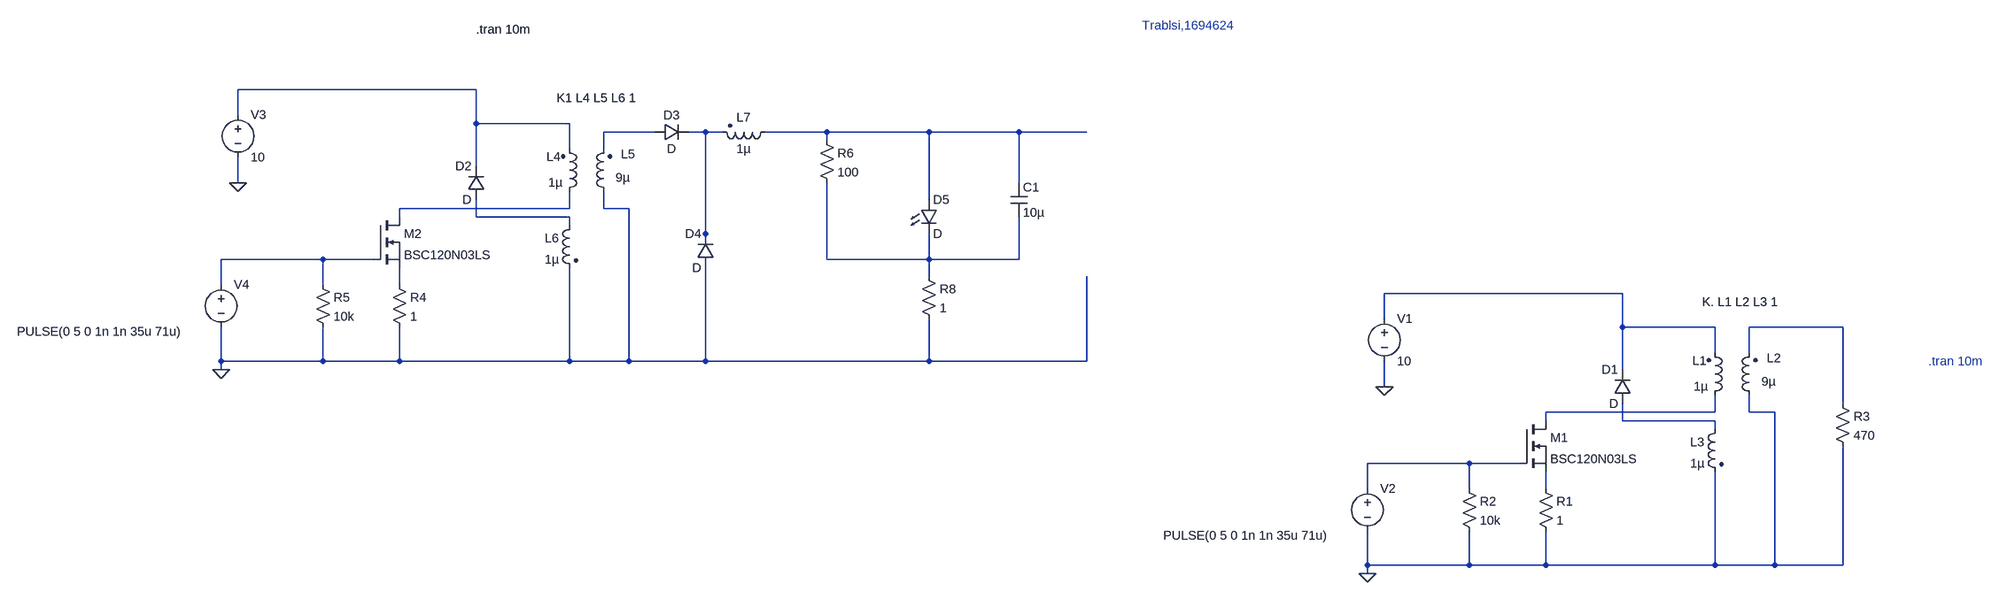
[diagram p0: schematic E8_2.asc]
E8_2.asc, the LTspice schematic file:
Version 4
SHEET 1 880 680
WIRE -2272 -432 -2720 -432
WIRE -2720 -384 -2720 -432
WIRE -2272 -368 -2272 -432
WIRE -2096 -368 -2272 -368
WIRE -1936 -352 -2032 -352
WIRE -1840 -352 -1872 -352
WIRE -1808 -352 -1840 -352
WIRE -1600 -352 -1728 -352
WIRE -1408 -352 -1600 -352
WIRE -1232 -352 -1408 -352
WIRE -1104 -352 -1232 -352
WIRE -1600 -336 -1600 -352
WIRE -2096 -320 -2096 -368
WIRE -2032 -320 -2032 -352
WIRE -2272 -288 -2272 -368
WIRE -2720 -256 -2720 -304
WIRE -1232 -256 -1232 -352
WIRE -1408 -224 -1408 -352
WIRE -2096 -208 -2096 -240
WIRE -2096 -208 -2416 -208
WIRE -2032 -208 -2032 -240
WIRE -1984 -208 -2032 -208
WIRE -2416 -192 -2416 -208
WIRE -2272 -192 -2272 -224
WIRE -2096 -192 -2272 -192
WIRE -2096 -176 -2096 -192
WIRE -1840 -160 -1840 -352
WIRE -1840 -144 -1840 -160
WIRE -2560 -112 -2752 -112
WIRE -2464 -112 -2560 -112
WIRE -1600 -112 -1600 -256
WIRE -1408 -112 -1408 -160
WIRE -1408 -112 -1600 -112
WIRE -1232 -112 -1232 -192
WIRE -1232 -112 -1408 -112
WIRE -1408 -80 -1408 -112
WIRE -2752 -64 -2752 -112
WIRE -2560 -64 -2560 -112
WIRE -2416 -64 -2416 -96
WIRE -16 -48 -464 -48
WIRE -464 0 -464 -48
WIRE -16 16 -16 -48
WIRE 160 16 -16 16
WIRE 432 16 224 16
WIRE 160 64 160 16
WIRE 224 64 224 16
WIRE -2752 80 -2752 16
WIRE -2560 80 -2560 16
WIRE -2560 80 -2752 80
WIRE -2416 80 -2416 16
WIRE -2416 80 -2560 80
WIRE -2096 80 -2096 -96
WIRE -2096 80 -2416 80
WIRE -1984 80 -1984 -208
WIRE -1984 80 -2096 80
WIRE -1840 80 -1840 -96
WIRE -1840 80 -1984 80
WIRE -1408 80 -1408 0
WIRE -1408 80 -1840 80
WIRE -1104 80 -1104 -80
WIRE -1104 80 -1408 80
WIRE -2752 96 -2752 80
WIRE -16 96 -16 16
WIRE -464 128 -464 80
WIRE 432 160 432 16
WIRE 160 176 160 144
WIRE 160 176 -160 176
WIRE 224 176 224 144
WIRE 272 176 224 176
WIRE -160 192 -160 176
WIRE -16 192 -16 160
WIRE 160 192 -16 192
WIRE 160 208 160 192
WIRE -304 272 -496 272
WIRE -208 272 -304 272
WIRE -496 320 -496 272
WIRE -304 320 -304 272
WIRE -160 320 -160 288
WIRE -496 464 -496 400
WIRE -304 464 -304 400
WIRE -304 464 -496 464
WIRE -160 464 -160 400
WIRE -160 464 -304 464
WIRE 160 464 160 288
WIRE 160 464 -160 464
WIRE 272 464 272 176
WIRE 272 464 160 464
WIRE 432 464 432 240
WIRE 432 464 272 464
WIRE -496 480 -496 464
FLAG -464 128 0
FLAG -496 480 0
FLAG -2720 -256 0
FLAG -2752 96 0
SYMBOL ind2 144 160 M180
WINDOW 0 -27 81 Left 2
WINDOW 3 -24 33 Left 2
SYMATTR InstName L1
SYMATTR Value 1µ
SYMBOL ind2 240 160 R180
WINDOW 0 -44 86 Left 2
WINDOW 3 -34 42 Left 2
SYMATTR InstName L2
SYMATTR Value 9µ
SYMBOL ind2 176 192 M0
SYMATTR InstName L3
SYMATTR Value 1µ
SYMBOL voltage -464 -16 R0
WINDOW 123 0 0 Left 0
WINDOW 39 0 0 Left 0
SYMATTR InstName V1
SYMATTR Value 10
SYMBOL diode 0 160 R180
WINDOW 0 24 64 Left 2
WINDOW 3 24 0 Left 2
SYMATTR InstName D1
SYMBOL res -176 304 R0
SYMATTR InstName R1
SYMATTR Value 1
SYMBOL res -320 304 R0
SYMATTR InstName R2
SYMATTR Value 10k
SYMBOL voltage -496 304 R0
WINDOW 3 -384 104 Left 2
WINDOW 123 0 0 Left 0
WINDOW 39 0 0 Left 0
SYMATTR Value PULSE(0 5 0 1n 1n 35u 71u)
SYMATTR InstName V2
SYMBOL res 416 144 R0
SYMATTR InstName R3
SYMATTR Value 470
SYMBOL nmos -208 192 R0
SYMATTR InstName M1
SYMATTR Value BSC120N03LS
SYMBOL ind2 -2112 -224 M180
WINDOW 0 -27 81 Left 2
WINDOW 3 -24 33 Left 2
SYMATTR InstName L4
SYMATTR Value 1µ
SYMBOL ind2 -2016 -224 R180
WINDOW 0 -44 86 Left 2
WINDOW 3 -34 42 Left 2
SYMATTR InstName L5
SYMATTR Value 9µ
SYMBOL ind2 -2080 -192 M0
SYMATTR InstName L6
SYMATTR Value 1µ
SYMBOL voltage -2720 -400 R0
WINDOW 123 0 0 Left 0
WINDOW 39 0 0 Left 0
SYMATTR InstName V3
SYMATTR Value 10
SYMBOL diode -2256 -224 R180
WINDOW 0 24 64 Left 2
WINDOW 3 24 0 Left 2
SYMATTR InstName D2
SYMBOL res -2432 -80 R0
SYMATTR InstName R4
SYMATTR Value 1
SYMBOL res -2576 -80 R0
SYMATTR InstName R5
SYMATTR Value 10k
SYMBOL voltage -2752 -80 R0
WINDOW 3 -384 104 Left 2
WINDOW 123 0 0 Left 0
WINDOW 39 0 0 Left 0
SYMATTR Value PULSE(0 5 0 1n 1n 35u 71u)
SYMATTR InstName V4
SYMBOL nmos -2464 -192 R0
SYMATTR InstName M2
SYMATTR Value BSC120N03LS
SYMBOL ind2 -1712 -368 R90
WINDOW 0 4 56 VBottom 2
WINDOW 3 32 56 VTop 2
SYMATTR InstName L7
SYMATTR Value 1µ
SYMBOL res -1616 -352 R0
SYMATTR InstName R6
SYMATTR Value 100
SYMBOL res -1424 -96 R0
SYMATTR InstName R8
SYMATTR Value 1
SYMBOL diode -1936 -336 R270
WINDOW 0 32 32 VTop 2
WINDOW 3 0 32 VBottom 2
SYMATTR InstName D3
SYMBOL diode -1824 -96 R180
WINDOW 0 24 64 Left 2
WINDOW 3 24 0 Left 2
SYMATTR InstName D4
SYMBOL LED -1424 -224 R0
SYMATTR InstName D5
SYMBOL cap -1248 -256 R0
SYMATTR InstName C1
SYMATTR Value 10µ
TEXT 136 -32 Left 2 !K. L1 L2 L3 1
TEXT 600 80 Left 2 ;.tran 10m
TEXT -2120 -416 Left 2 !K1 L4 L5 L6 1
TEXT -2272 -600 Left 2 !.tran 10m
TEXT -920 -608 Left 2 ;Trablsi,1694624

The netlist it stands for:
* E8_2.asc
L1 N012 N010 1µ
L2 0 N011 9µ
L3 N013 0 1µ
V1 N010 0 10
D1 N013 N010 D
R1 N015 0 1
R2 N014 0 10k
V2 N014 0 PULSE(0 5 0 1n 1n 35u 71u)
R3 N011 0 470
M1 N012 N014 N015 N015 BSC120N03LS
L4 N005 N001 1µ
L5 0 N002 9µ
L6 N006 0 1µ
V3 N001 0 10
D2 N006 N001 D
R4 N009 0 1
R5 N007 0 10k
V4 N007 0 PULSE(0 5 0 1n 1n 35u 71u)
M2 N005 N007 N009 N009 BSC120N03LS
L7 N004 N003 1µ
R6 N004 N008 100
R8 N008 0 1
D3 N002 N003 D
D4 0 N003 D
D5 N004 N008 D
C1 N004 N008 10µ
.model D D
.lib standard.dio
.model NMOS NMOS
.model PMOS PMOS
.lib standard.mos
K. L1 L2 L3 1
* .tran 10m
K1 L4 L5 L6 1
.tran 10m
* Trablsi,1694624
.backanno
.end